# Altium schematic sheet M12_Connector.SchDoc
size A
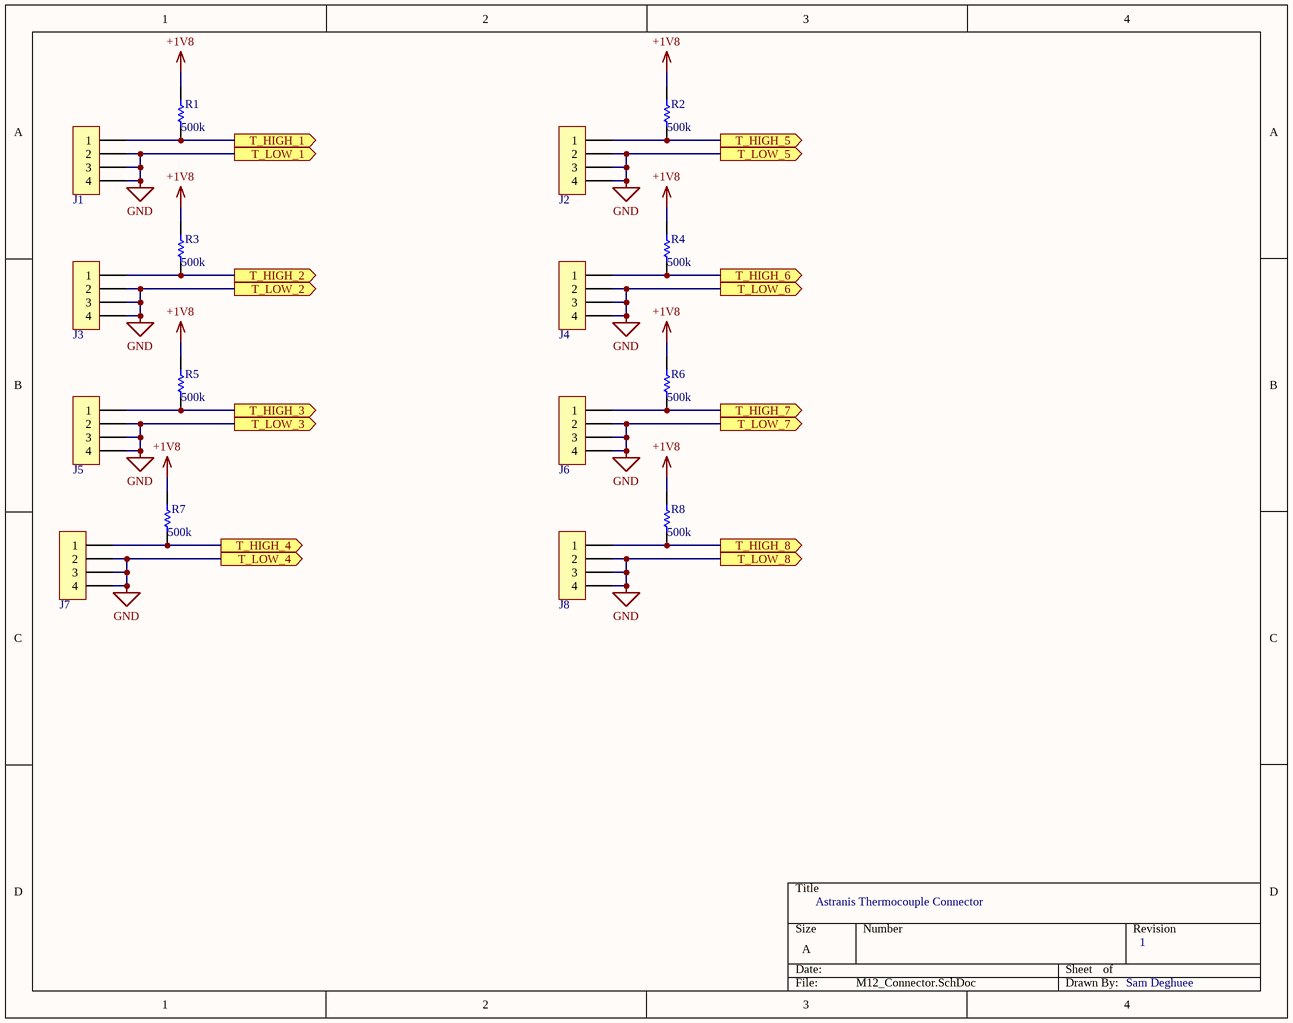
[diagram p0: M12_Connector.SchDoc]

## Parts
J1  M12 PCB Pannel Mount  (value not drawn)
J2  M12 PCB Pannel Mount  (value not drawn)
J3  M12 PCB Pannel Mount  (value not drawn)
J4  M12 PCB Pannel Mount  (value not drawn)
J5  M12 PCB Pannel Mount  (value not drawn)
J6  M12 PCB Pannel Mount  (value not drawn)
J7  M12 PCB Pannel Mount  (value not drawn)
J8  M12 PCB Pannel Mount  (value not drawn)
R1  value 500k  [RESC0603(1608)_L]  (hidden comment: RES0603)
R2  value 500k  [RESC0603(1608)_L]  (hidden comment: RES0603)
R3  value 500k  [RESC0603(1608)_L]  (hidden comment: RES0603)
R4  value 500k  [RESC0603(1608)_L]  (hidden comment: RES0603)
R5  value 500k  [RESC0603(1608)_L]  (hidden comment: RES0603)
R6  value 500k  [RESC0603(1608)_L]  (hidden comment: RES0603)
R7  value 500k  [RESC0603(1608)_L]  (hidden comment: RES0603)
R8  value 500k  [RESC0603(1608)_L]  (hidden comment: RES0603)

## Ports
T_HIGH_1 (out), T_HIGH_2 (out), T_HIGH_3 (out), T_HIGH_4 (out), T_HIGH_5 (out), T_HIGH_6 (out), T_HIGH_7 (out), T_HIGH_8 (out), T_LOW_1 (out), T_LOW_2 (out), T_LOW_3 (out), T_LOW_4 (out), T_LOW_5 (out), T_LOW_6 (out), T_LOW_7 (out), T_LOW_8 (out)

## Nets
+1V8: R1.2 R2.2 R3.2 R4.2 R5.2 R6.2 R7.2 R8.2
GND: J1.?2(2) J1.?3(3) J1.?4(4) J2.?2(2) J2.?3(3) J2.?4(4) J3.?2(2) J3.?3(3) J3.?4(4) J4.?2(2) J4.?3(3) J4.?4(4) J5.?2(2) J5.?3(3) J5.?4(4) J6.?2(2) J6.?3(3) J6.?4(4) J7.?2(2) J7.?3(3) J7.?4(4) J8.?2(2) J8.?3(3) J8.?4(4) ; port T_LOW_1, port T_LOW_2, port T_LOW_3, port T_LOW_4, port T_LOW_5, port T_LOW_6, port T_LOW_7, port T_LOW_8
T_HIGH_1: J1.?1(1) R1.1 ; port T_HIGH_1
T_HIGH_2: J3.?1(1) R3.1 ; port T_HIGH_2
T_HIGH_3: J5.?1(1) R5.1 ; port T_HIGH_3
T_HIGH_4: J7.?1(1) R7.1 ; port T_HIGH_4
T_HIGH_5: J2.?1(1) R2.1 ; port T_HIGH_5
T_HIGH_6: J4.?1(1) R4.1 ; port T_HIGH_6
T_HIGH_7: J6.?1(1) R6.1 ; port T_HIGH_7
T_HIGH_8: J8.?1(1) R8.1 ; port T_HIGH_8

## Notes on the sheet
- Astranis Thermocouple Connector
- 1
- Sam Deghuee

## Library data of the parts
J1-J8 = M12: M12,REAR MOUNTING,MALE,A CODE,4P
R1-R8 = CMP-1591-00001-1: 0603 (1608 Metric) Chip Resistor; Case-Metric: 1608; Case-EIA: 0603; PackageReference: RESC0603(1608)